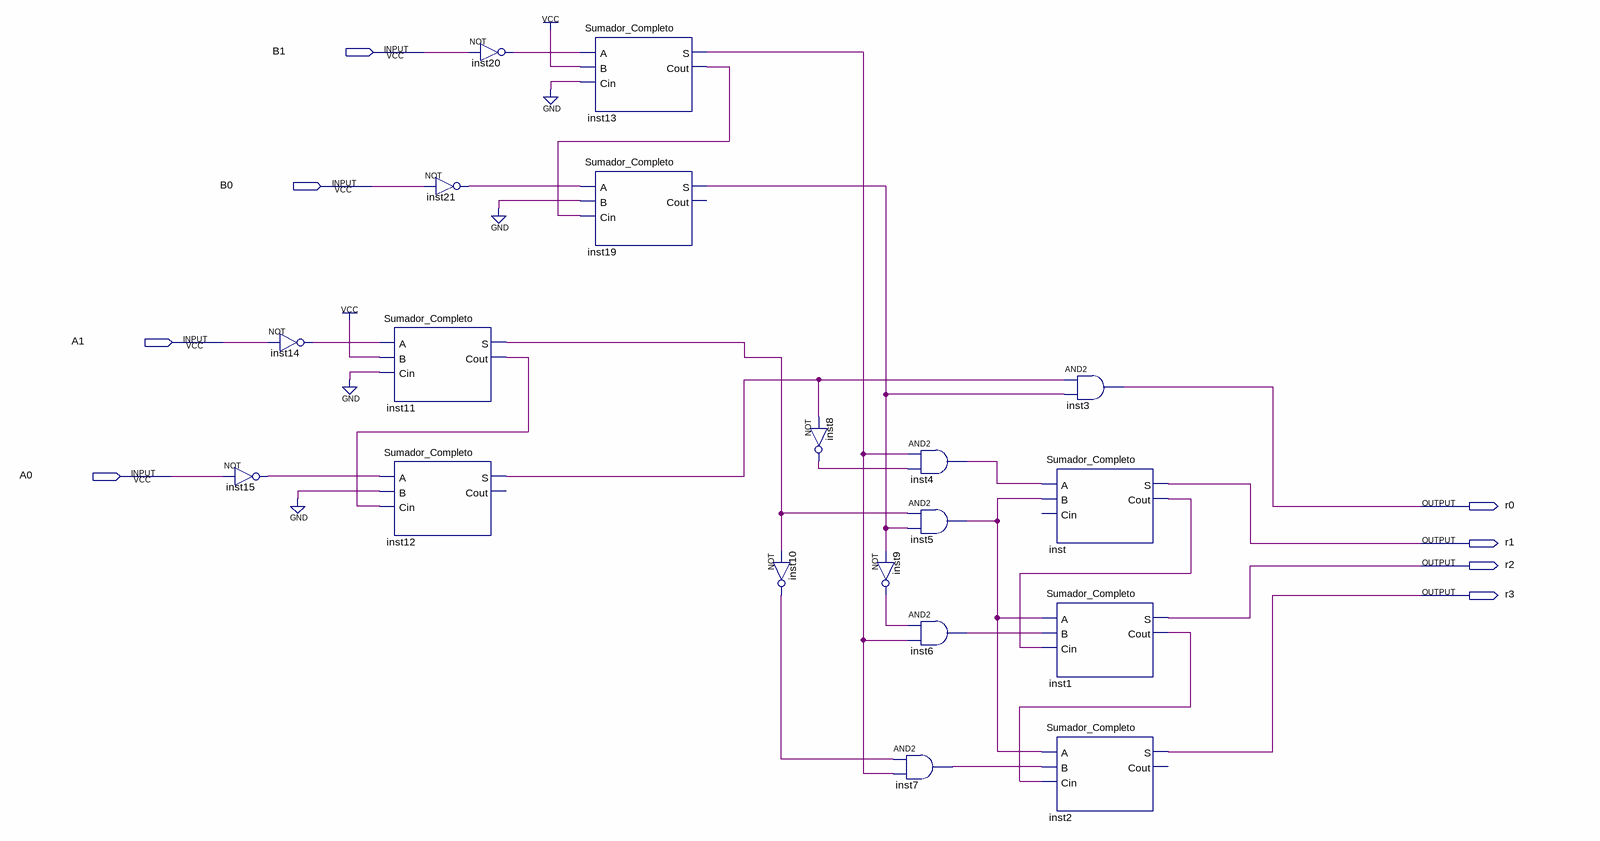
[diagram p0: schematic sheet]
// Quartus schematic multiplicador_signo_otro.bdf as structural Verilog: 19 symbols, 8 pins
module multiplicador_signo_otro (
  input  B1,
  input  B0,
  input  A1,
  input  A0,
  output r0,
  output r1,
  output r2,
  output r3
);

  wire inst1_cout, inst4_out, inst5_out, inst6_out, inst7_out, inst8_out, inst9_out, inst10_out, inst11_cout,
       inst11_s, inst12_s, inst13_cout, inst13_s, inst14_out, inst15_out, inst19_s, inst20_out, inst21_out,
       inst_cout;

  not inst15 (inst15_out, A0);
  not inst14 (inst14_out, A1);
  Sumador_Completo inst11 (.A(inst14_out), .B(1'b1), .Cin(1'b0), .S(inst11_s), .Cout(inst11_cout));
  Sumador_Completo inst12 (.A(inst15_out), .B(1'b0), .Cin(inst11_cout), .S(inst12_s));  // open: Cout
  not inst21 (inst21_out, B0);
  not inst20 (inst20_out, B1);
  Sumador_Completo inst13 (.A(inst20_out), .B(1'b1), .Cin(1'b0), .S(inst13_s), .Cout(inst13_cout));
  Sumador_Completo inst19 (.A(inst21_out), .B(1'b0), .Cin(inst13_cout), .S(inst19_s));  // open: Cout
  not inst8 (inst8_out, inst12_s);
  not inst10 (inst10_out, inst11_s);
  not inst9 (inst9_out, inst19_s);
  and inst4 (inst4_out, inst13_s, inst8_out);
  and inst5 (inst5_out, inst11_s, inst19_s);
  and inst6 (inst6_out, inst9_out, inst13_s);
  and inst7 (inst7_out, inst10_out, inst13_s);
  Sumador_Completo inst (.A(inst4_out), .B(inst5_out), .S(r1), .Cout(inst_cout));  // open: Cin
  Sumador_Completo inst1 (.A(inst5_out), .B(inst6_out), .Cin(inst_cout), .S(r2), .Cout(inst1_cout));
  Sumador_Completo inst2 (.A(inst5_out), .B(inst7_out), .Cin(inst1_cout), .S(r3));  // open: Cout
  and inst3 (r0, inst12_s, inst19_s);
endmodule
